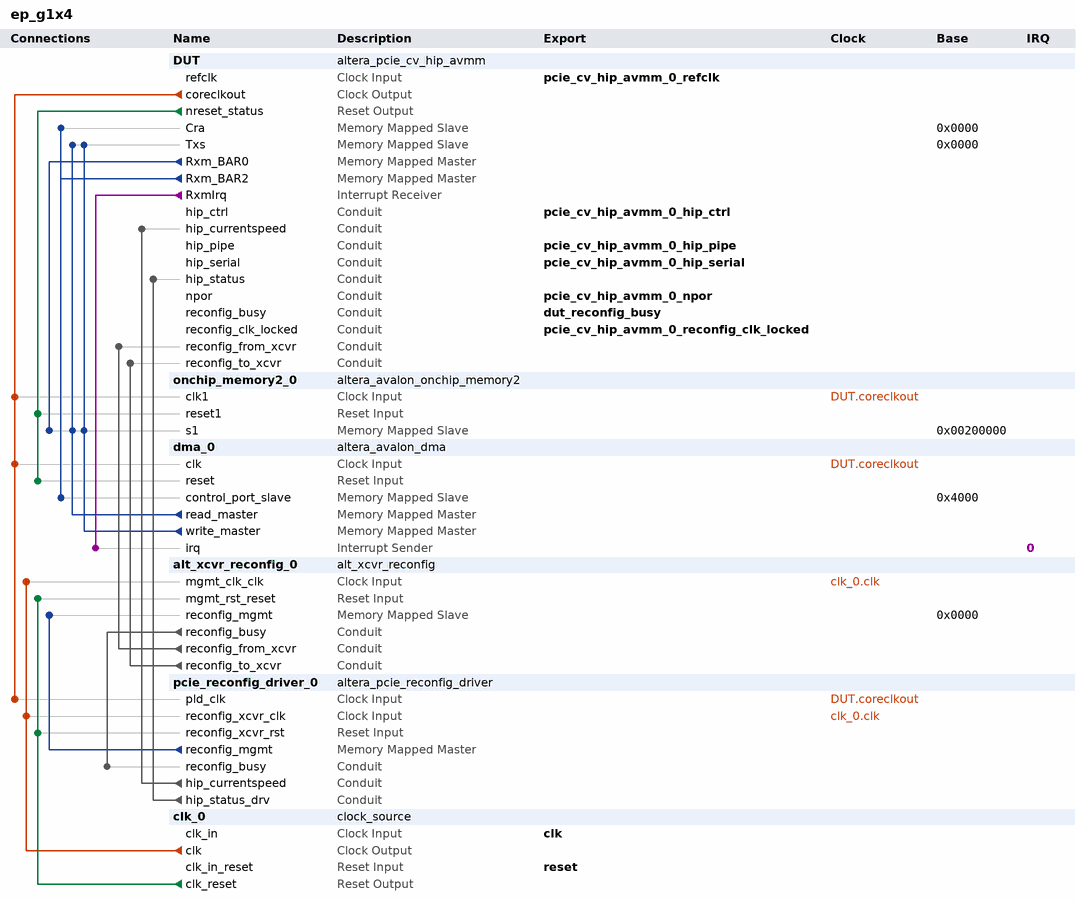
[diagram p0: system contents]
# Platform Designer (Qsys) system ep_g1x4, Cyclone V Unknown
# Parameters at their usual value, and those the tool derives, are not listed.
package require -exact qsys 16.0
create_system ep_g1x4
set_project_property DEVICE_FAMILY {Cyclone V}
set_project_property DEVICE Unknown

add_instance DUT altera_pcie_cv_hip_avmm 16.0
set_instance_parameter_value DUT AST_LITE 0
set_instance_parameter_value DUT AVALON_ADDR_WIDTH 32
set_instance_parameter_value DUT AddressPage "0\\,1\\,2\\,3\\,4\\,5\\,6\\,7\\,8\\,9\\,10\\,11\\,12\\,13\\,14\\,15"
set_instance_parameter_value DUT BYPASSS_A2P_TRANSLATION 0
set_instance_parameter_value DUT CB_A2P_ADDR_MAP_FIXED_TABLE_0_HIGH 0
set_instance_parameter_value DUT CB_A2P_ADDR_MAP_FIXED_TABLE_0_LOW 0
set_instance_parameter_value DUT CB_A2P_ADDR_MAP_FIXED_TABLE_10_HIGH 0
set_instance_parameter_value DUT CB_A2P_ADDR_MAP_FIXED_TABLE_10_LOW 0
set_instance_parameter_value DUT CB_A2P_ADDR_MAP_FIXED_TABLE_11_HIGH 0
set_instance_parameter_value DUT CB_A2P_ADDR_MAP_FIXED_TABLE_11_LOW 0
set_instance_parameter_value DUT CB_A2P_ADDR_MAP_FIXED_TABLE_12_HIGH 0
set_instance_parameter_value DUT CB_A2P_ADDR_MAP_FIXED_TABLE_12_LOW 0
set_instance_parameter_value DUT CB_A2P_ADDR_MAP_FIXED_TABLE_13_HIGH 0
set_instance_parameter_value DUT CB_A2P_ADDR_MAP_FIXED_TABLE_13_LOW 0
set_instance_parameter_value DUT CB_A2P_ADDR_MAP_FIXED_TABLE_14_HIGH 0
set_instance_parameter_value DUT CB_A2P_ADDR_MAP_FIXED_TABLE_14_LOW 0
set_instance_parameter_value DUT CB_A2P_ADDR_MAP_FIXED_TABLE_15_HIGH 0
set_instance_parameter_value DUT CB_A2P_ADDR_MAP_FIXED_TABLE_15_LOW 0
set_instance_parameter_value DUT CB_A2P_ADDR_MAP_FIXED_TABLE_1_HIGH 0
set_instance_parameter_value DUT CB_A2P_ADDR_MAP_FIXED_TABLE_1_LOW 0
set_instance_parameter_value DUT CB_A2P_ADDR_MAP_FIXED_TABLE_2_HIGH 0
set_instance_parameter_value DUT CB_A2P_ADDR_MAP_FIXED_TABLE_2_LOW 0
set_instance_parameter_value DUT CB_A2P_ADDR_MAP_FIXED_TABLE_3_HIGH 0
set_instance_parameter_value DUT CB_A2P_ADDR_MAP_FIXED_TABLE_3_LOW 0
set_instance_parameter_value DUT CB_A2P_ADDR_MAP_FIXED_TABLE_4_HIGH 0
set_instance_parameter_value DUT CB_A2P_ADDR_MAP_FIXED_TABLE_4_LOW 0
set_instance_parameter_value DUT CB_A2P_ADDR_MAP_FIXED_TABLE_5_HIGH 0
set_instance_parameter_value DUT CB_A2P_ADDR_MAP_FIXED_TABLE_5_LOW 0
set_instance_parameter_value DUT CB_A2P_ADDR_MAP_FIXED_TABLE_6_HIGH 0
set_instance_parameter_value DUT CB_A2P_ADDR_MAP_FIXED_TABLE_6_LOW 0
set_instance_parameter_value DUT CB_A2P_ADDR_MAP_FIXED_TABLE_7_HIGH 0
set_instance_parameter_value DUT CB_A2P_ADDR_MAP_FIXED_TABLE_7_LOW 0
set_instance_parameter_value DUT CB_A2P_ADDR_MAP_FIXED_TABLE_8_HIGH 0
set_instance_parameter_value DUT CB_A2P_ADDR_MAP_FIXED_TABLE_8_LOW 0
set_instance_parameter_value DUT CB_A2P_ADDR_MAP_FIXED_TABLE_9_HIGH 0
set_instance_parameter_value DUT CB_A2P_ADDR_MAP_FIXED_TABLE_9_LOW 0
set_instance_parameter_value DUT CB_A2P_ADDR_MAP_IS_FIXED 0
set_instance_parameter_value DUT CB_A2P_ADDR_MAP_NUM_ENTRIES 2
set_instance_parameter_value DUT CB_A2P_ADDR_MAP_PASS_THRU_BITS 20
set_instance_parameter_value DUT CB_P2A_AVALON_ADDR_B0 0x00000000
set_instance_parameter_value DUT CB_P2A_AVALON_ADDR_B1 0x00000000
set_instance_parameter_value DUT CB_P2A_AVALON_ADDR_B2 0x00000000
set_instance_parameter_value DUT CB_P2A_AVALON_ADDR_B3 0x00000000
set_instance_parameter_value DUT CB_P2A_AVALON_ADDR_B4 0x00000000
set_instance_parameter_value DUT CB_P2A_AVALON_ADDR_B5 0x00000000
set_instance_parameter_value DUT CB_P2A_FIXED_AVALON_ADDR_B0 0
set_instance_parameter_value DUT CB_P2A_FIXED_AVALON_ADDR_B1 0
set_instance_parameter_value DUT CB_P2A_FIXED_AVALON_ADDR_B2 0
set_instance_parameter_value DUT CB_P2A_FIXED_AVALON_ADDR_B3 0
set_instance_parameter_value DUT CB_P2A_FIXED_AVALON_ADDR_B4 0
set_instance_parameter_value DUT CB_P2A_FIXED_AVALON_ADDR_B5 0
set_instance_parameter_value DUT CB_PCIE_MODE 0
set_instance_parameter_value DUT CB_PCIE_RX_LITE 0
set_instance_parameter_value DUT CB_RP_S_ADDR_WIDTH 32
set_instance_parameter_value DUT CG_COMMON_CLOCK_MODE 1
set_instance_parameter_value DUT CG_ENABLE_A2P_INTERRUPT 0
set_instance_parameter_value DUT CG_ENABLE_ADVANCED_INTERRUPT 0
set_instance_parameter_value DUT CG_ENABLE_HIP_STATUS 1
set_instance_parameter_value DUT CG_ENABLE_HIP_STATUS_EXTENSION 0
set_instance_parameter_value DUT CG_IMPL_CRA_AV_SLAVE_PORT 1
set_instance_parameter_value DUT CG_RXM_IRQ_NUM 16
set_instance_parameter_value DUT NUM_PREFETCH_MASTERS 1
set_instance_parameter_value DUT PCIeAddress31_0 "0x00000000\\,0x00000000\\,0x00000000\\,0x00000000\\,0x00000000\\,0x00000000\\,0x00000000\\,0x00000000\\,0x00000000\\,0x00000000\\,0x00000000\\,0x00000000\\,0x00000000\\,0x00000000\\,0x00000000\\,0x00000000"
set_instance_parameter_value DUT PCIeAddress63_32 "0x00000000\\,0x00000000\\,0x00000000\\,0x00000000\\,0x00000000\\,0x00000000\\,0x00000000\\,0x00000000\\,0x00000000\\,0x00000000\\,0x00000000\\,0x00000000\\,0x00000000\\,0x00000000\\,0x00000000\\,0x00000000"
set_instance_parameter_value DUT RXM_BEN_WIDTH 8
set_instance_parameter_value DUT RXM_DATA_WIDTH 64
set_instance_parameter_value DUT SLAVE_ADDRESS_MAP_0 22
set_instance_parameter_value DUT SLAVE_ADDRESS_MAP_1 0
set_instance_parameter_value DUT SLAVE_ADDRESS_MAP_2 15
set_instance_parameter_value DUT SLAVE_ADDRESS_MAP_3 0
set_instance_parameter_value DUT SLAVE_ADDRESS_MAP_4 0
set_instance_parameter_value DUT SLAVE_ADDRESS_MAP_5 0
set_instance_parameter_value DUT TX_S_ADDR_WIDTH 32
set_instance_parameter_value DUT advanced_default_parameter_override 0
set_instance_parameter_value DUT altpcie_avmm_hwtcl 1
set_instance_parameter_value DUT atomic_malformed_hwtcl true
set_instance_parameter_value DUT atomic_op_completer_32bit_hwtcl false
set_instance_parameter_value DUT atomic_op_completer_64bit_hwtcl false
set_instance_parameter_value DUT atomic_op_routing_hwtcl false
set_instance_parameter_value DUT avmm_width_hwtcl 64
set_instance_parameter_value DUT bar0_type_hwtcl 1
set_instance_parameter_value DUT bar1_type_hwtcl 0
set_instance_parameter_value DUT bar2_type_hwtcl 2
set_instance_parameter_value DUT bar3_type_hwtcl 0
set_instance_parameter_value DUT bar4_type_hwtcl 0
set_instance_parameter_value DUT bar5_type_hwtcl 0
set_instance_parameter_value DUT bridge_port_ssid_support_hwtcl false
set_instance_parameter_value DUT bridge_port_vga_enable_hwtcl false
set_instance_parameter_value DUT bypass_cdc_hwtcl false
set_instance_parameter_value DUT bypass_tl false
set_instance_parameter_value DUT cas_completer_128bit_hwtcl false
set_instance_parameter_value DUT cdc_dummy_insert_limit_advanced_default_hwtcl 11
set_instance_parameter_value DUT class_code_hwtcl 0
set_instance_parameter_value DUT completion_timeout_hwtcl ABCD
set_instance_parameter_value DUT coreclkout_hip_phaseshift_hwtcl {0 ps}
set_instance_parameter_value DUT d0_pme_advanced_default_hwtcl false
set_instance_parameter_value DUT d1_pme_advanced_default_hwtcl false
set_instance_parameter_value DUT d1_support_advanced_default_hwtcl false
set_instance_parameter_value DUT d2_pme_advanced_default_hwtcl false
set_instance_parameter_value DUT d2_support_advanced_default_hwtcl false
set_instance_parameter_value DUT d3_cold_pme_advanced_default_hwtcl false
set_instance_parameter_value DUT d3_hot_pme_advanced_default_hwtcl false
set_instance_parameter_value DUT data_pack_rx_hwtcl disable
set_instance_parameter_value DUT deemphasis_enable_advanced_default_hwtcl false
set_instance_parameter_value DUT deskew_comma_hwtcl skp_eieos_deskw
set_instance_parameter_value DUT device_id_hwtcl 1
set_instance_parameter_value DUT device_number_advanced_default_hwtcl 0
set_instance_parameter_value DUT diffclock_nfts_count_advanced_default_hwtcl 255
set_instance_parameter_value DUT disable_link_x2_support_advanced_default_hwtcl false
set_instance_parameter_value DUT disable_snoop_packet_hwtcl false
set_instance_parameter_value DUT dll_active_report_support_hwtcl 0
set_instance_parameter_value DUT ecrc_check_capable_hwtcl 0
set_instance_parameter_value DUT ecrc_gen_capable_hwtcl 0
set_instance_parameter_value DUT ei_delay_powerdown_count_advanced_default_hwtcl 10
set_instance_parameter_value DUT eie_before_nfts_count_advanced_default_hwtcl 4
set_instance_parameter_value DUT enable_completion_timeout_disable_hwtcl 1
set_instance_parameter_value DUT enable_function_msix_support_hwtcl 0
set_instance_parameter_value DUT enable_l0s_aspm_hwtcl true
set_instance_parameter_value DUT enable_l1_aspm_advanced_default_hwtcl false
set_instance_parameter_value DUT enable_rx_buffer_checking_advanced_default_hwtcl false
set_instance_parameter_value DUT enable_slot_register_hwtcl 0
set_instance_parameter_value DUT endpoint_l0_latency_hwtcl 0
set_instance_parameter_value DUT endpoint_l1_latency_hwtcl 0
set_instance_parameter_value DUT expansion_base_address_register_hwtcl 0
set_instance_parameter_value DUT extend_tag_field_hwtcl 32
set_instance_parameter_value DUT extended_format_field_hwtcl true
set_instance_parameter_value DUT extended_tag_reset_hwtcl false
set_instance_parameter_value DUT fc_init_timer_advanced_default_hwtcl 1024
set_instance_parameter_value DUT fixed_address_mode 0
set_instance_parameter_value DUT flow_control_timeout_count_advanced_default_hwtcl 200
set_instance_parameter_value DUT flow_control_update_count_advanced_default_hwtcl 30
set_instance_parameter_value DUT flr_capability_hwtcl 1
set_instance_parameter_value DUT force_hrc 0
set_instance_parameter_value DUT force_src 0
set_instance_parameter_value DUT gen123_lane_rate_mode_hwtcl {Gen1 (2.5 Gbps)}
set_instance_parameter_value DUT gen2_diffclock_nfts_count_advanced_default_hwtcl 255
set_instance_parameter_value DUT gen2_sameclock_nfts_count_advanced_default_hwtcl 255
set_instance_parameter_value DUT gen3_rxfreqlock_counter_hwtcl 0
set_instance_parameter_value DUT hip_reconfig_hwtcl 0
set_instance_parameter_value DUT hot_plug_support_advanced_default_hwtcl 0
set_instance_parameter_value DUT in_cvp_mode_hwtcl 0
set_instance_parameter_value DUT indicator_advanced_default_hwtcl 0
set_instance_parameter_value DUT interrupt_pin_hwtcl inta
set_instance_parameter_value DUT io_window_addr_width_hwtcl 0
set_instance_parameter_value DUT l01_entry_latency_advanced_default_hwtcl 31
set_instance_parameter_value DUT l0_exit_latency_diffclock_advanced_default_hwtcl 6
set_instance_parameter_value DUT l0_exit_latency_sameclock_advanced_default_hwtcl 6
set_instance_parameter_value DUT l1_exit_latency_diffclock_advanced_default_hwtcl 0
set_instance_parameter_value DUT l1_exit_latency_sameclock_advanced_default_hwtcl 0
set_instance_parameter_value DUT l2_async_logic_advanced_default_hwtcl disable
set_instance_parameter_value DUT lane_mask_hwtcl x4
set_instance_parameter_value DUT low_priority_vc_advanced_default_hwtcl single_vc
set_instance_parameter_value DUT ltr_mechanism_hwtcl false
set_instance_parameter_value DUT ltssm_1ms_timeout_hwtcl disable
set_instance_parameter_value DUT ltssm_freqlocked_check_hwtcl disable
set_instance_parameter_value DUT max_payload_size_hwtcl 128
set_instance_parameter_value DUT maximum_current_hwtcl 0
set_instance_parameter_value DUT msi_64bit_addressing_capable_hwtcl true
set_instance_parameter_value DUT msi_masking_capable_hwtcl false
set_instance_parameter_value DUT msi_multi_message_capable_hwtcl 4
set_instance_parameter_value DUT msi_support_hwtcl true
set_instance_parameter_value DUT msix_pba_bir_hwtcl 0
set_instance_parameter_value DUT msix_pba_offset_hwtcl 0
set_instance_parameter_value DUT msix_table_bir_hwtcl 0
set_instance_parameter_value DUT msix_table_offset_hwtcl 0
set_instance_parameter_value DUT msix_table_size_hwtcl 0
set_instance_parameter_value DUT no_command_completed_advanced_default_hwtcl false
set_instance_parameter_value DUT no_soft_reset_advanced_default_hwtcl false
set_instance_parameter_value DUT override_rxbuffer_cred_preset 0
set_instance_parameter_value DUT override_tbpartner_driver_setting_hwtcl 0
set_instance_parameter_value DUT pcie_qsys 1
set_instance_parameter_value DUT pclk_out_sel_advanced_default_hwtcl pclk
set_instance_parameter_value DUT pipex1_debug_sel_advanced_default_hwtcl disable
set_instance_parameter_value DUT pldclk_hip_phase_shift_hwtcl {0 ps}
set_instance_parameter_value DUT pll_refclk_freq_hwtcl {100 MHz}
set_instance_parameter_value DUT port_link_number_hwtcl 1
set_instance_parameter_value DUT port_type_hwtcl {Native endpoint}
set_instance_parameter_value DUT prefetchable_mem_window_addr_width_hwtcl 0
set_instance_parameter_value DUT register_pipe_signals_advanced_default_hwtcl true
set_instance_parameter_value DUT reserved_debug_advanced_default_hwtcl 0
set_instance_parameter_value DUT retry_buffer_last_active_address_advanced_default_hwtcl 255
set_instance_parameter_value DUT revision_id_hwtcl 1
set_instance_parameter_value DUT rpre_emph_a_val_hwtcl 11
set_instance_parameter_value DUT rpre_emph_b_val_hwtcl 0
set_instance_parameter_value DUT rpre_emph_c_val_hwtcl 22
set_instance_parameter_value DUT rpre_emph_d_val_hwtcl 12
set_instance_parameter_value DUT rpre_emph_e_val_hwtcl 21
set_instance_parameter_value DUT rvod_sel_a_val_hwtcl 50
set_instance_parameter_value DUT rvod_sel_b_val_hwtcl 34
set_instance_parameter_value DUT rvod_sel_c_val_hwtcl 50
set_instance_parameter_value DUT rvod_sel_d_val_hwtcl 50
set_instance_parameter_value DUT rvod_sel_e_val_hwtcl 9
set_instance_parameter_value DUT rx_cdc_almost_full_advanced_default_hwtcl 12
set_instance_parameter_value DUT rx_l0s_count_idl_advanced_default_hwtcl 0
set_instance_parameter_value DUT rxbuffer_rxreq_hwtcl Low
set_instance_parameter_value DUT sameclock_nfts_count_advanced_default_hwtcl 255
set_instance_parameter_value DUT serial_sim_hwtcl 0
set_instance_parameter_value DUT set_pld_clk_x1_625MHz_hwtcl 0
set_instance_parameter_value DUT skp_os_gen3_count_hwtcl 0
set_instance_parameter_value DUT skp_os_schedule_count_advanced_default_hwtcl 0
set_instance_parameter_value DUT slot_number_hwtcl 0
set_instance_parameter_value DUT slot_power_limit_hwtcl 0
set_instance_parameter_value DUT slot_power_scale_hwtcl 0
set_instance_parameter_value DUT slotclkcfg_hwtcl 1
set_instance_parameter_value DUT ssid_hwtcl 0
set_instance_parameter_value DUT ssvid_hwtcl 0
set_instance_parameter_value DUT subsystem_device_id_hwtcl 0
set_instance_parameter_value DUT subsystem_vendor_id_hwtcl 0
set_instance_parameter_value DUT surprise_down_error_support_hwtcl 0
set_instance_parameter_value DUT tph_completer_hwtcl false
set_instance_parameter_value DUT tx_cdc_almost_empty_advanced_default_hwtcl 5
set_instance_parameter_value DUT tx_cdc_almost_full_advanced_default_hwtcl 11
set_instance_parameter_value DUT use_aer_hwtcl 0
set_instance_parameter_value DUT use_ast_parity 0
set_instance_parameter_value DUT use_crc_forwarding_hwtcl 0
set_instance_parameter_value DUT use_rx_st_be_hwtcl 0
set_instance_parameter_value DUT use_tl_cfg_sync_advanced_default_hwtcl 1
set_instance_parameter_value DUT user_id_hwtcl 0
set_instance_parameter_value DUT vc0_clk_enable_advanced_default_hwtcl true
set_instance_parameter_value DUT vendor_id_hwtcl 0
set_instance_parameter_value DUT vsec_id_hwtcl 40960
set_instance_parameter_value DUT vsec_rev_hwtcl 0
set_instance_parameter_value DUT wrong_device_id_hwtcl disable

add_instance onchip_memory2_0 altera_avalon_onchip_memory2 16.0
set_instance_parameter_value onchip_memory2_0 dataWidth 64
set_instance_parameter_value onchip_memory2_0 dualPort false
set_instance_parameter_value onchip_memory2_0 initMemContent false
set_instance_parameter_value onchip_memory2_0 initializationFileName onchip_memory2_0
set_instance_parameter_value onchip_memory2_0 memorySize 4096

add_instance dma_0 altera_avalon_dma 16.0
set_instance_parameter_value dma_0 allowByteTransactions true
set_instance_parameter_value dma_0 allowDoubleWordTransactions true
set_instance_parameter_value dma_0 allowHalfWordTransactions true
set_instance_parameter_value dma_0 allowQuadWordTransactions true
set_instance_parameter_value dma_0 burstEnable true
set_instance_parameter_value dma_0 fifoDepth 32
set_instance_parameter_value dma_0 maxBurstSize 128
set_instance_parameter_value dma_0 minimumDmaTransactionRegisterWidth 13

add_instance alt_xcvr_reconfig_0 alt_xcvr_reconfig 16.0
set_instance_parameter_value alt_xcvr_reconfig_0 device_family {Cyclone V}
set_instance_parameter_value alt_xcvr_reconfig_0 enable_adce 0
set_instance_parameter_value alt_xcvr_reconfig_0 enable_analog 1
set_instance_parameter_value alt_xcvr_reconfig_0 number_of_reconfig_interfaces 5

add_instance pcie_reconfig_driver_0 altera_pcie_reconfig_driver 16.0
set_instance_parameter_value pcie_reconfig_driver_0 gen123_lane_rate_mode_hwtcl {Gen1 (2.5 Gbps)}
set_instance_parameter_value pcie_reconfig_driver_0 number_of_reconfig_interfaces 5

add_instance clk_0 clock_source 16.0
set_instance_parameter_value clk_0 clockFrequency 125000000

# connections
add_connection clk_0.clk alt_xcvr_reconfig_0.mgmt_clk_clk clock
add_connection clk_0.clk pcie_reconfig_driver_0.reconfig_xcvr_clk clock
add_connection DUT.coreclkout dma_0.clk clock
add_connection DUT.coreclkout onchip_memory2_0.clk1 clock
add_connection DUT.coreclkout pcie_reconfig_driver_0.pld_clk clock
add_connection clk_0.clk_reset alt_xcvr_reconfig_0.mgmt_rst_reset reset
add_connection clk_0.clk_reset pcie_reconfig_driver_0.reconfig_xcvr_rst reset
add_connection DUT.nreset_status dma_0.reset reset
add_connection DUT.nreset_status onchip_memory2_0.reset1 reset
add_connection dma_0.read_master DUT.Txs avalon
set_connection_parameter_value dma_0.read_master/DUT.Txs baseAddress 0x0000
add_connection dma_0.read_master onchip_memory2_0.s1 avalon
set_connection_parameter_value dma_0.read_master/onchip_memory2_0.s1 baseAddress 0x00200000
add_connection dma_0.write_master DUT.Txs avalon
set_connection_parameter_value dma_0.write_master/DUT.Txs baseAddress 0x0000
add_connection dma_0.write_master onchip_memory2_0.s1 avalon
set_connection_parameter_value dma_0.write_master/onchip_memory2_0.s1 baseAddress 0x00200000
add_connection DUT.Rxm_BAR0 onchip_memory2_0.s1 avalon
set_connection_parameter_value DUT.Rxm_BAR0/onchip_memory2_0.s1 baseAddress 0x00200000
add_connection DUT.Rxm_BAR2 dma_0.control_port_slave avalon
set_connection_parameter_value DUT.Rxm_BAR2/dma_0.control_port_slave baseAddress 0x4000
add_connection DUT.Rxm_BAR2 DUT.Cra avalon
set_connection_parameter_value DUT.Rxm_BAR2/DUT.Cra baseAddress 0x0000
add_connection pcie_reconfig_driver_0.reconfig_mgmt alt_xcvr_reconfig_0.reconfig_mgmt avalon
set_connection_parameter_value pcie_reconfig_driver_0.reconfig_mgmt/alt_xcvr_reconfig_0.reconfig_mgmt baseAddress 0x0000
add_connection alt_xcvr_reconfig_0.reconfig_busy pcie_reconfig_driver_0.reconfig_busy conduit
add_connection alt_xcvr_reconfig_0.reconfig_from_xcvr DUT.reconfig_from_xcvr conduit
add_connection alt_xcvr_reconfig_0.reconfig_to_xcvr DUT.reconfig_to_xcvr conduit
add_connection pcie_reconfig_driver_0.hip_currentspeed DUT.hip_currentspeed conduit
add_connection pcie_reconfig_driver_0.hip_status_drv DUT.hip_status conduit
add_connection DUT.RxmIrq dma_0.irq interrupt
set_connection_parameter_value DUT.RxmIrq/dma_0.irq irqNumber 0

# exported interfaces
add_interface clk clock sink
set_interface_property clk EXPORT_OF clk_0.clk_in
add_interface dut_reconfig_busy conduit end
set_interface_property dut_reconfig_busy EXPORT_OF DUT.reconfig_busy
add_interface pcie_cv_hip_avmm_0_hip_ctrl conduit end
set_interface_property pcie_cv_hip_avmm_0_hip_ctrl EXPORT_OF DUT.hip_ctrl
add_interface pcie_cv_hip_avmm_0_hip_pipe conduit end
set_interface_property pcie_cv_hip_avmm_0_hip_pipe EXPORT_OF DUT.hip_pipe
add_interface pcie_cv_hip_avmm_0_hip_serial conduit end
set_interface_property pcie_cv_hip_avmm_0_hip_serial EXPORT_OF DUT.hip_serial
add_interface pcie_cv_hip_avmm_0_npor conduit end
set_interface_property pcie_cv_hip_avmm_0_npor EXPORT_OF DUT.npor
add_interface pcie_cv_hip_avmm_0_reconfig_clk_locked conduit end
set_interface_property pcie_cv_hip_avmm_0_reconfig_clk_locked EXPORT_OF DUT.reconfig_clk_locked
add_interface pcie_cv_hip_avmm_0_refclk clock sink
set_interface_property pcie_cv_hip_avmm_0_refclk EXPORT_OF DUT.refclk
add_interface reset reset sink
set_interface_property reset EXPORT_OF clk_0.clk_in_reset

set_interconnect_requirement {$system} qsys_mm.clockCrossingAdapter HANDSHAKE
set_interconnect_requirement {$system} qsys_mm.maxAdditionalLatency 1

save_system ep_g1x4.qsys
